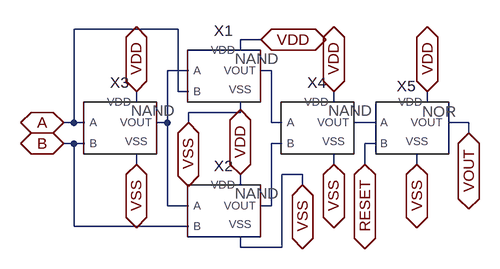
[diagram p0: schematic XNOR_Reset.asc]
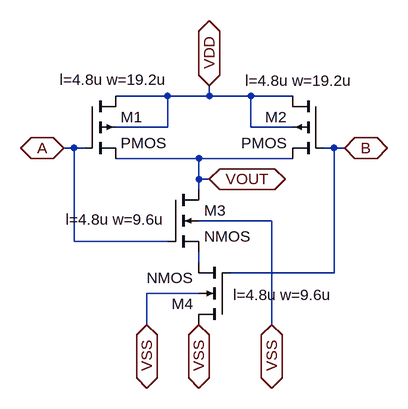
[diagram p1: sub-circuit nand.asc]
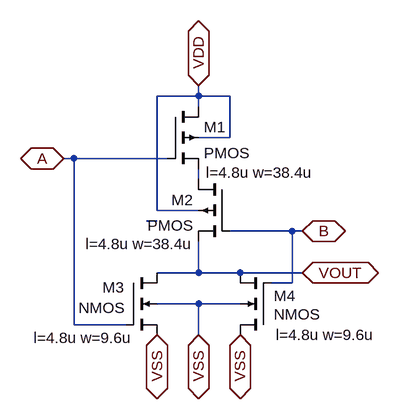
[diagram p2: sub-circuit nor.asc]
XNOR_Reset.asc, the LTspice schematic file:
Version 4
SHEET 1 880 680
WIRE -16 16 -176 16
WIRE 112 32 80 32
WIRE 80 48 80 32
WIRE 0 80 -32 80
WIRE 128 80 112 80
WIRE -16 112 -16 16
WIRE 0 112 -16 112
WIRE -80 128 -80 112
WIRE 224 128 224 112
WIRE 368 128 368 112
WIRE 80 144 80 128
WIRE 80 144 0 144
WIRE -176 160 -176 16
WIRE -176 160 -192 160
WIRE -160 160 -176 160
WIRE -32 160 -32 80
WIRE -32 160 -48 160
WIRE 0 160 0 144
WIRE 128 160 128 80
WIRE 144 160 128 160
WIRE 288 160 256 160
WIRE 432 160 400 160
WIRE 432 176 432 160
WIRE -176 192 -192 192
WIRE -160 192 -176 192
WIRE 144 192 128 192
WIRE 288 192 272 192
WIRE -80 224 -80 208
WIRE 224 224 224 208
WIRE 272 224 272 192
WIRE 352 224 352 208
WIRE 176 240 144 240
WIRE 80 256 80 240
WIRE 176 256 176 240
WIRE -32 288 -32 160
WIRE 0 288 -32 288
WIRE 128 288 128 192
WIRE 128 288 112 288
WIRE -176 320 -176 192
WIRE 0 320 -176 320
WIRE 80 352 80 336
WIRE 144 352 144 240
WIRE 144 352 80 352
FLAG 112 32 VDD
IOPIN 112 32 BiDir
FLAG 80 240 VDD
IOPIN 80 240 BiDir
FLAG -80 112 VDD
IOPIN -80 112 BiDir
FLAG 224 112 VDD
IOPIN 224 112 BiDir
FLAG 368 112 VDD
IOPIN 368 112 BiDir
FLAG -192 160 A
IOPIN -192 160 BiDir
FLAG -192 192 B
IOPIN -192 192 BiDir
FLAG 272 224 RESET
IOPIN 272 224 BiDir
FLAG 432 176 VOUT
IOPIN 432 176 BiDir
FLAG -80 224 VSS
IOPIN -80 224 BiDir
FLAG 0 160 VSS
IOPIN 0 160 BiDir
FLAG 176 256 VSS
IOPIN 176 256 BiDir
FLAG 224 224 VSS
IOPIN 224 224 BiDir
FLAG 352 224 VSS
IOPIN 352 224 BiDir
SYMBOL nand 48 96 R0
SYMATTR InstName X1
SYMBOL nand 48 304 R0
SYMATTR InstName X2
SYMBOL nand -112 176 R0
SYMATTR InstName X3
SYMBOL nand 192 176 R0
SYMATTR InstName X4
SYMBOL nor 336 176 R0
SYMATTR InstName X5

nand.asc, the sub-circuit schematic file:
Version 4
SHEET 1 880 680
WIRE 208 32 128 32
WIRE 272 32 272 16
WIRE 272 32 208 32
WIRE 336 32 272 32
WIRE 400 32 336 32
WIRE 208 80 208 32
WIRE 208 80 128 80
WIRE 336 80 336 32
WIRE 400 80 336 80
WIRE 64 112 48 112
WIRE 80 112 64 112
WIRE 464 112 448 112
WIRE 480 112 464 112
WIRE 256 128 128 128
WIRE 400 128 256 128
WIRE 256 160 256 128
WIRE 272 160 256 160
WIRE 256 176 256 160
WIRE 368 224 256 224
WIRE 64 256 64 112
WIRE 208 256 64 256
WIRE 256 288 256 272
WIRE 464 304 464 112
WIRE 464 304 304 304
WIRE 256 336 176 336
WIRE 176 384 176 336
WIRE 368 384 368 224
FLAG 256 384 VSS
IOPIN 256 384 BiDir
FLAG 48 112 A
IOPIN 48 112 BiDir
FLAG 480 112 B
IOPIN 480 112 BiDir
FLAG 176 384 VSS
IOPIN 176 384 BiDir
FLAG 272 16 VDD
IOPIN 272 16 BiDir
FLAG 368 384 VSS
IOPIN 368 384 BiDir
FLAG 272 160 VOUT
IOPIN 272 160 BiDir
SYMBOL pmos4 80 32 R0
WINDOW 123 -38 -25 Left 2
SYMATTR Value2 l=4.8u w=19.2u
SYMATTR InstName M1
SYMBOL pmos4 448 32 M0
WINDOW 123 -45 -24 Left 2
SYMATTR Value2 l=4.8u w=19.2u
SYMATTR InstName M2
SYMBOL nmos4 208 176 R0
WINDOW 123 -157 46 Left 2
SYMATTR Value2 l=4.8u w=9.6u
SYMATTR InstName M3
SYMBOL nmos4 304 384 R180
WINDOW 123 -157 46 Left 2
SYMATTR Value2 l=4.8u w=9.6u
SYMATTR InstName M4

nor.asc, the sub-circuit schematic file:
Version 4
SHEET 1 888 680
WIRE 400 -112 400 -128
WIRE 400 -112 336 -112
WIRE 448 -112 400 -112
WIRE 400 -96 400 -112
WIRE 448 -48 448 -112
WIRE 448 -48 400 -48
WIRE 208 -16 192 -16
WIRE 352 -16 208 -16
WIRE 400 16 400 0
WIRE 336 64 336 -112
WIRE 400 64 336 64
WIRE 336 80 320 80
WIRE 544 96 448 96
WIRE 560 96 544 96
WIRE 400 160 400 112
WIRE 400 160 336 160
WIRE 464 160 400 160
WIRE 560 160 464 160
WIRE 544 176 544 96
WIRE 544 176 512 176
WIRE 400 208 336 208
WIRE 464 208 400 208
WIRE 208 240 208 -16
WIRE 288 240 208 240
WIRE 400 256 400 208
FLAG 192 -16 A
IOPIN 192 -16 BiDir
FLAG 560 96 B
IOPIN 560 96 BiDir
FLAG 400 -128 VDD
IOPIN 400 -128 BiDir
FLAG 560 160 VOUT
IOPIN 560 160 BiDir
FLAG 336 256 VSS
IOPIN 336 256 BiDir
FLAG 464 256 VSS
IOPIN 464 256 BiDir
FLAG 400 256 VSS
IOPIN 400 256 BiDir
SYMBOL pmos4 352 -96 R0
WINDOW 123 59 102 Left 2
SYMATTR Value2 l=4.8u w=38.4u
SYMATTR InstName M1
SYMBOL pmos4 448 16 M0
WINDOW 123 56 100 Left 2
WINDOW 3 56 71 Left 2
SYMATTR Value2 l=4.8u w=38.4u
SYMATTR InstName M2
SYMBOL nmos4 288 160 R0
WINDOW 123 -142 100 Left 2
WINDOW 0 -36 23 Left 2
WINDOW 3 -73 54 Left 2
SYMATTR Value2 l=4.8u w=9.6u
SYMATTR InstName M3
SYMBOL nmos4 512 256 R180
WINDOW 123 -159 0 Left 2
WINDOW 0 -38 60 Left 2
WINDOW 3 -76 32 Left 2
SYMATTR Value2 l=4.8u w=9.6u
SYMATTR InstName M4

The netlist it stands for:
* XNOR_Reset.asc
XX1 N001 A VDD N002 VSS nand
XX2 N001 B VDD N004 VSS nand
XX3 A B VDD N001 VSS nand
XX4 N002 N004 VDD N003 VSS nand
XX5 N003 RESET VDD VOUT VSS nor

* block symbol definitions
.subckt nand A B VDD VOUT VSS
M1 VDD A VOUT VDD PMOS l=4.8u w=19.2u
M2 VDD B VOUT VDD PMOS l=4.8u w=19.2u
M3 VOUT A N001 VSS NMOS l=4.8u w=9.6u
M4 VSS B N001 VSS NMOS l=4.8u w=9.6u
.ends nand

.subckt nor A B VDD VOUT VSS
M1 VDD A N001 VDD PMOS l=4.8u w=38.4u
M2 N001 B VOUT VDD PMOS l=4.8u w=38.4u
M3 VOUT A VSS VSS NMOS l=4.8u w=9.6u
M4 VSS B VOUT VSS NMOS l=4.8u w=9.6u
.ends nor

.model NMOS NMOS
.model PMOS PMOS
.lib standard.mos
.backanno
.end